# EAGLE design stairs (EAGLE 9.2.0)
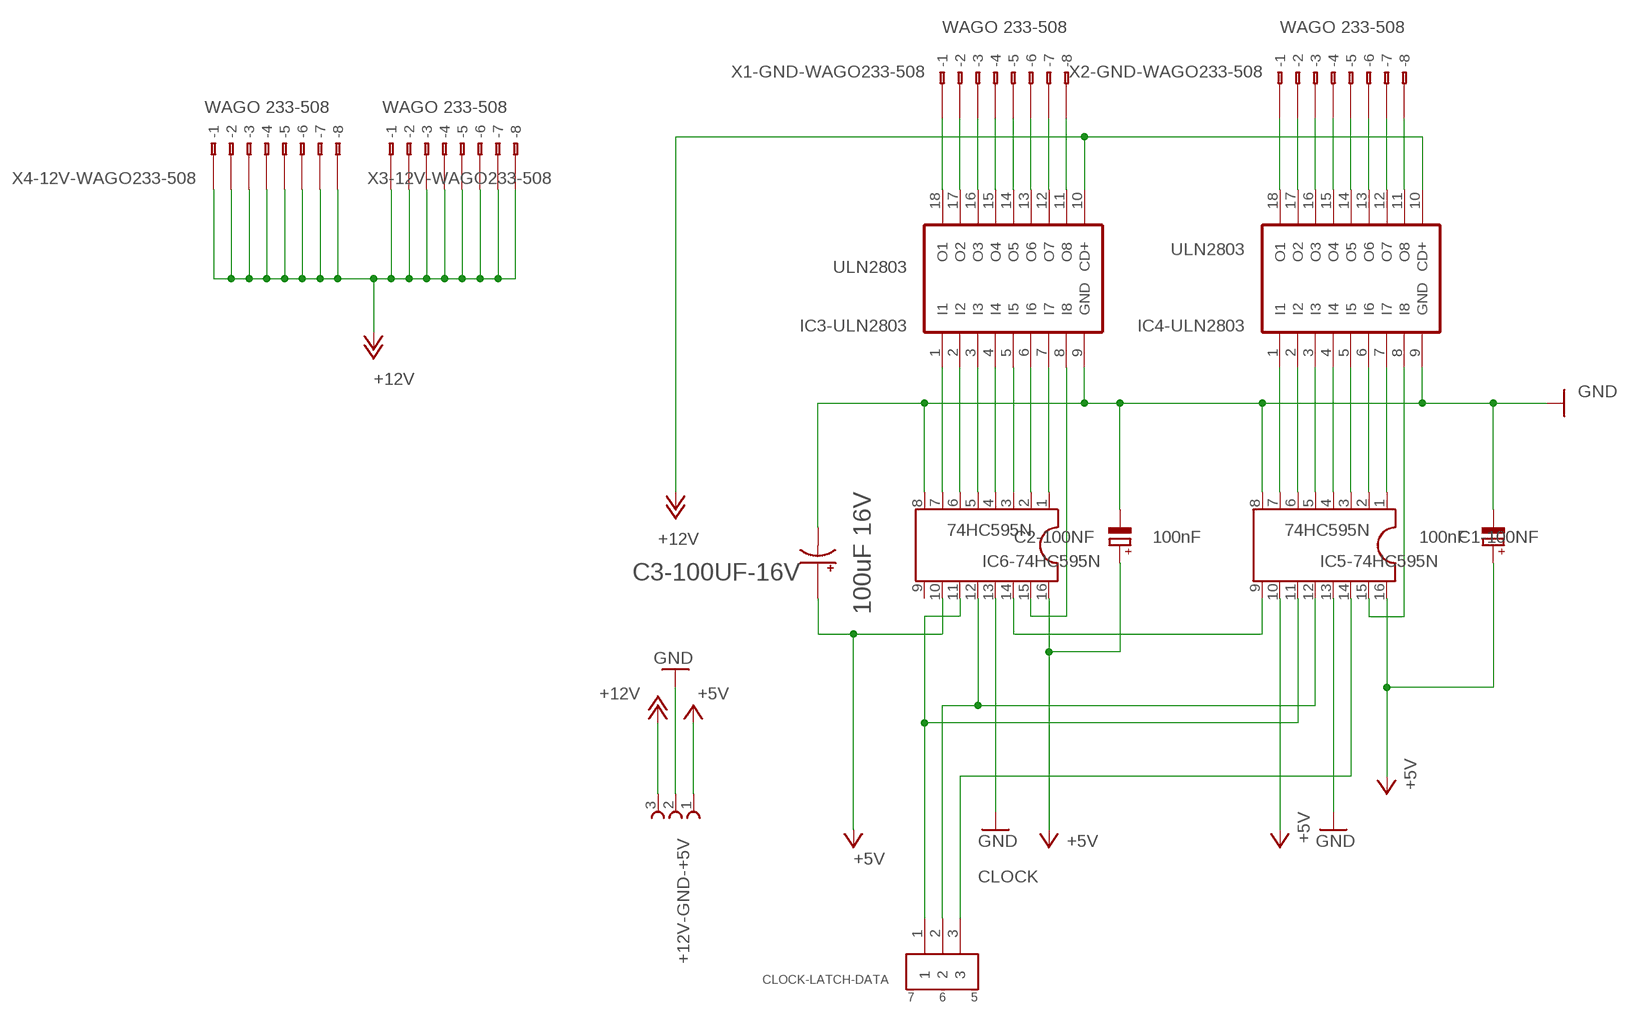
[diagram p0: schematic, sheet 1]

## Parts
+12V-GND-+5V  +12V GND +5V  691212710003  [691212710003]
C1-100NF  100nF  CPOL-EUE2,5-6E  [E2,5-6E]
C2-100NF  100nF  CPOL-EUE2,5-6E  [E2,5-6E]
C3-100UF-16V  100uF 16V  RNE1C101MDS1PX  [CAPPRD200W50D500H1000]
CLOCK-LATCH-DATA  7 6 5  0022272031  [MOLEX_0022272031]
IC3-ULN2803  ULN2803  ULN2803A  [DIL18]
IC4-ULN2803  ULN2803  ULN2803A  [DIL18]
IC5-74HC595N  74HC595N  DIL16  [DIL16]
IC6-74HC595N  74HC595N  DIL16  [DIL16]
X1-GND-WAGO233-508  WAGO 233-508  233-508  [233-508]
X2-GND-WAGO233-508  WAGO 233-508  233-508  [233-508]
X3-12V-WAGO233-508  WAGO 233-508  233-508  [233-508]
X4-12V-WAGO233-508  WAGO 233-508  233-508  [233-508]

## Nets
+5V: +12V-GND-+5V.1 C1-100NF.+ C2-100NF.+ C3-100UF-16V.1(P) IC5-74HC595N.10 IC5-74HC595N.16 IC6-74HC595N.10 IC6-74HC595N.16
+12V: +12V-GND-+5V.3 IC3-ULN2803.10(CD+) IC4-ULN2803.10(CD+) X3-12V-WAGO233-508.B1(B-1) X3-12V-WAGO233-508.B2(B-2) X3-12V-WAGO233-508.B3(B-3) X3-12V-WAGO233-508.B4(B-4) X3-12V-WAGO233-508.B5(B-5) X3-12V-WAGO233-508.B6(B-6) X3-12V-WAGO233-508.B7(B-7) X3-12V-WAGO233-508.B8(B-8) X4-12V-WAGO233-508.B1(B-1) X4-12V-WAGO233-508.B2(B-2) X4-12V-WAGO233-508.B3(B-3) X4-12V-WAGO233-508.B4(B-4) X4-12V-WAGO233-508.B5(B-5) X4-12V-WAGO233-508.B6(B-6) X4-12V-WAGO233-508.B7(B-7) X4-12V-WAGO233-508.B8(B-8)
CLOCK: CLOCK-LATCH-DATA.3 IC5-74HC595N.14
GND: +12V-GND-+5V.2 C1-100NF.- C2-100NF.- C3-100UF-16V.2(N) IC3-ULN2803.9(GND) IC4-ULN2803.9(GND) IC5-74HC595N.8 IC5-74HC595N.13 IC6-74HC595N.8 IC6-74HC595N.13
N$1: IC3-ULN2803.8(I8) IC6-74HC595N.15
N$2: IC3-ULN2803.1(I1) IC6-74HC595N.7
N$3: IC3-ULN2803.2(I2) IC6-74HC595N.6
N$4: IC3-ULN2803.3(I3) IC6-74HC595N.5
N$5: IC3-ULN2803.4(I4) IC6-74HC595N.4
N$6: IC3-ULN2803.5(I5) IC6-74HC595N.3
N$7: IC3-ULN2803.6(I6) IC6-74HC595N.2
N$8: IC3-ULN2803.7(I7) IC6-74HC595N.1
N$9: IC4-ULN2803.1(I1) IC5-74HC595N.7
N$10: IC4-ULN2803.2(I2) IC5-74HC595N.6
N$11: IC4-ULN2803.3(I3) IC5-74HC595N.5
N$12: IC4-ULN2803.4(I4) IC5-74HC595N.4
N$13: IC4-ULN2803.5(I5) IC5-74HC595N.3
N$14: IC4-ULN2803.6(I6) IC5-74HC595N.2
N$15: IC4-ULN2803.7(I7) IC5-74HC595N.1
N$16: IC3-ULN2803.18(O1) X1-GND-WAGO233-508.B1(B-1)
N$17: IC3-ULN2803.17(O2) X1-GND-WAGO233-508.B2(B-2)
N$18: IC3-ULN2803.16(O3) X1-GND-WAGO233-508.B3(B-3)
N$19: IC3-ULN2803.15(O4) X1-GND-WAGO233-508.B4(B-4)
N$20: IC3-ULN2803.14(O5) X1-GND-WAGO233-508.B5(B-5)
N$21: IC3-ULN2803.13(O6) X1-GND-WAGO233-508.B6(B-6)
N$22: IC3-ULN2803.12(O7) X1-GND-WAGO233-508.B7(B-7)
N$23: IC3-ULN2803.11(O8) X1-GND-WAGO233-508.B8(B-8)
N$24: IC4-ULN2803.18(O1) X2-GND-WAGO233-508.B1(B-1)
N$25: IC4-ULN2803.17(O2) X2-GND-WAGO233-508.B2(B-2)
N$26: IC4-ULN2803.16(O3) X2-GND-WAGO233-508.B3(B-3)
N$27: IC4-ULN2803.15(O4) X2-GND-WAGO233-508.B4(B-4)
N$28: IC4-ULN2803.14(O5) X2-GND-WAGO233-508.B5(B-5)
N$29: IC4-ULN2803.13(O6) X2-GND-WAGO233-508.B6(B-6)
N$30: IC4-ULN2803.12(O7) X2-GND-WAGO233-508.B7(B-7)
N$31: IC4-ULN2803.11(O8) X2-GND-WAGO233-508.B8(B-8)
N$32: CLOCK-LATCH-DATA.1 IC5-74HC595N.11 IC6-74HC595N.11
N$33: CLOCK-LATCH-DATA.2 IC5-74HC595N.12 IC6-74HC595N.12
N$34: IC5-74HC595N.9 IC6-74HC595N.14
N$35: IC4-ULN2803.8(I8) IC5-74HC595N.15
Unconnected: IC6-74HC595N.9 X1-GND-WAGO233-508.A1(-1) X1-GND-WAGO233-508.A2(-2) X1-GND-WAGO233-508.A3(-3) X1-GND-WAGO233-508.A4(-4) X1-GND-WAGO233-508.A5(-5) X1-GND-WAGO233-508.A6(-6) X1-GND-WAGO233-508.A7(-7) X1-GND-WAGO233-508.A8(-8) X2-GND-WAGO233-508.A1(-1) X2-GND-WAGO233-508.A2(-2) X2-GND-WAGO233-508.A3(-3) X2-GND-WAGO233-508.A4(-4) X2-GND-WAGO233-508.A5(-5) X2-GND-WAGO233-508.A6(-6) X2-GND-WAGO233-508.A7(-7) X2-GND-WAGO233-508.A8(-8) X3-12V-WAGO233-508.A1(-1) X3-12V-WAGO233-508.A2(-2) X3-12V-WAGO233-508.A3(-3) X3-12V-WAGO233-508.A4(-4) X3-12V-WAGO233-508.A5(-5) X3-12V-WAGO233-508.A6(-6) X3-12V-WAGO233-508.A7(-7) X3-12V-WAGO233-508.A8(-8) X4-12V-WAGO233-508.A1(-1) X4-12V-WAGO233-508.A2(-2) X4-12V-WAGO233-508.A3(-3) X4-12V-WAGO233-508.A4(-4) X4-12V-WAGO233-508.A5(-5) X4-12V-WAGO233-508.A6(-6) X4-12V-WAGO233-508.A7(-7) X4-12V-WAGO233-508.A8(-8)

## Library data of the parts
+12V-GND-+5V = 691212710003:691212710003: WR-TBL Serie 212 - 5.0mm 45° Entry Modular with Rising Cage Clamp - 3.5mm2 Wires, 3 Pins=>Code : Con_TBL_Screw_RisingClamp_5.00_691212710003 Created 2014-06-18, Karrer Zheng 2014 (C) Würth Elektronik; AVAILABILITY: Unavailable; DESCRIPTION: Green; Number of pins 3; Stackable; Screw terminal, Print; MF: Wurth Electronics; MP: 691212710003; PACKAGE: None; PRICE: None
C1-100NF C2-100NF = rcl:CPOL-EU: POLARIZED CAPACITOR, European symbol; SPICEPREFIX: C
C3-100UF-16V = RNE1C101MDS1PX:RNE1C101MDS1PX: CAP ALUM POLY 100UF 20% 16V T/H; AVAILABILITY: Unavailable; DESCRIPTION: Cap Aluminum Polymer 100uF 16VDC 20% _5 X 10mm_ Radial 2mm 0.035 Ohm 2300mA 2000h 105C T/R; MF: Nichicon; MP: RNE1C101MDS1PX; PACKAGE: Radial Nichicon; PRICE: None
CLOCK-LATCH-DATA = 0022272031:0022272031: CONN HEADER 3POS .100 VERT TIN; AVAILABILITY: Unavailable; DESCRIPTION: 2.54mm _.100_ Pitch KK® Wire-to-Board Header, Vertical, with Friction Lock, 3 Circuits, Tin _Sn_ Plating; MF: Molex, LLC; MP: 0022272031; PACKAGE: None; PRICE: None
IC3-ULN2803 IC4-ULN2803 = uln-udn:ULN2803A: DRIVER ARRAY
IC5-74HC595N IC6-74HC595N = ic-package:DIL16: Dual In Line / Socket
X1-GND-WAGO233-508 X2-GND-WAGO233-508 = 233-508:233-508: WAGO Cage Clamp; AVAILABILITY: Unavailable; DESCRIPTION: Spring-loaded terminal 0.50 mm² Number of pins 8 PCB T.STR. 8 POL. 2, 54 MM ORANGE WAGO Orange 220 pc_s_; MF: WAGO; MP: 233-508; PACKAGE: None; PRICE: None
X3-12V-WAGO233-508 X4-12V-WAGO233-508 = con-wago:233-508: WAGO Cage Clamp; MF: Wago Corporation; MPN: 0233-0508; OC_FARNELL: 1777101; OC_NEWARK: 79K2053

## Board
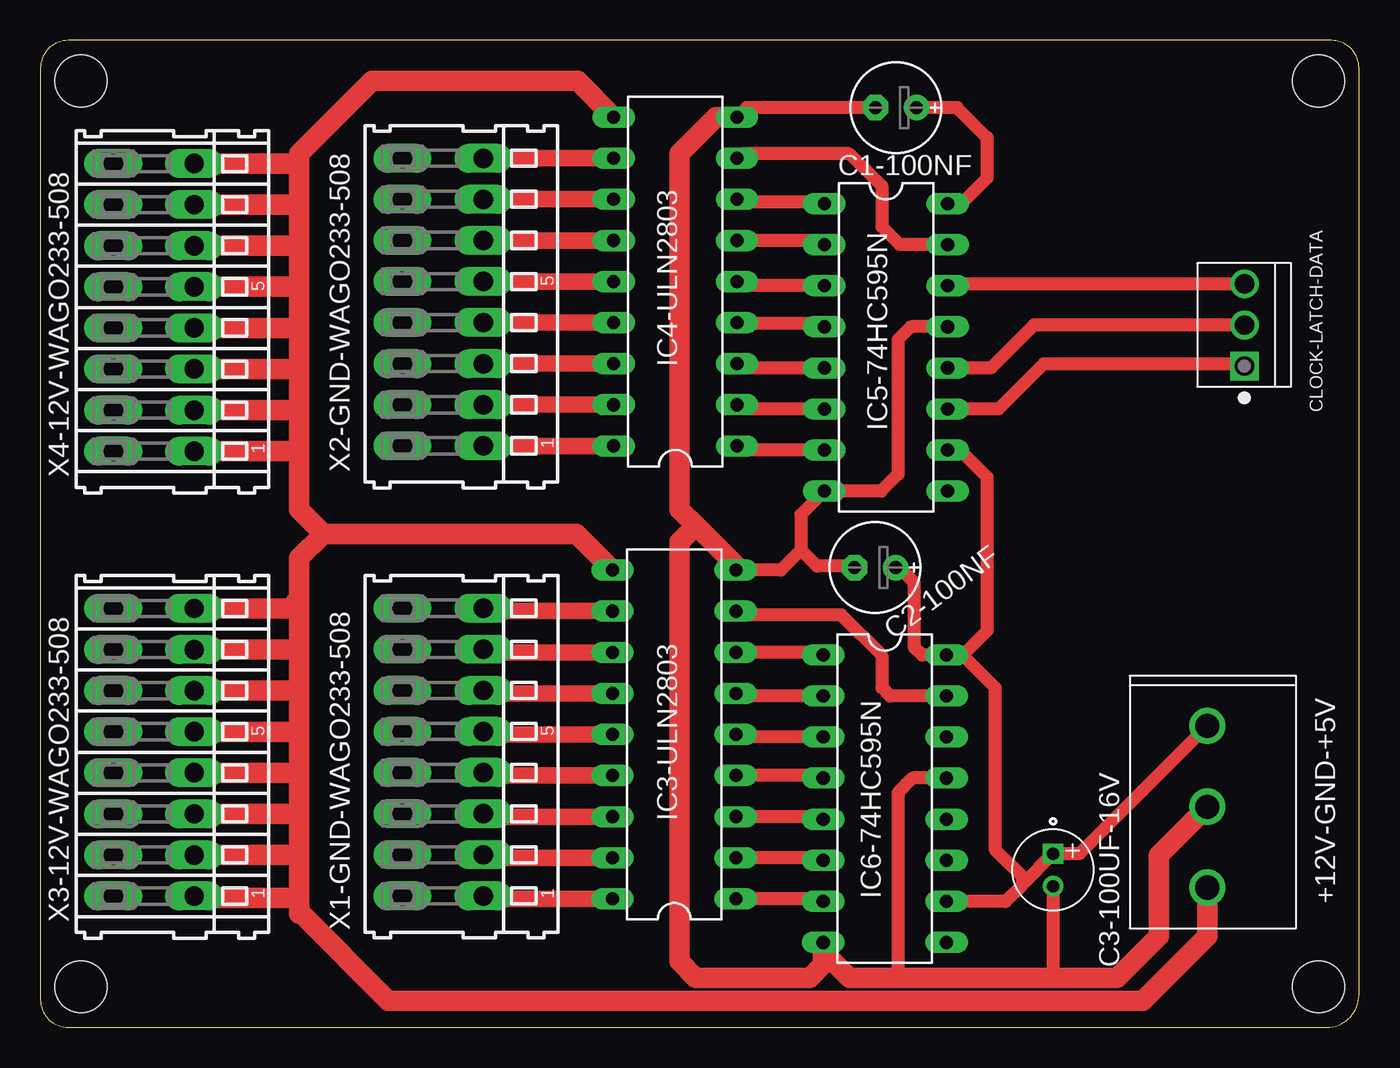
[diagram p1: board, top side]
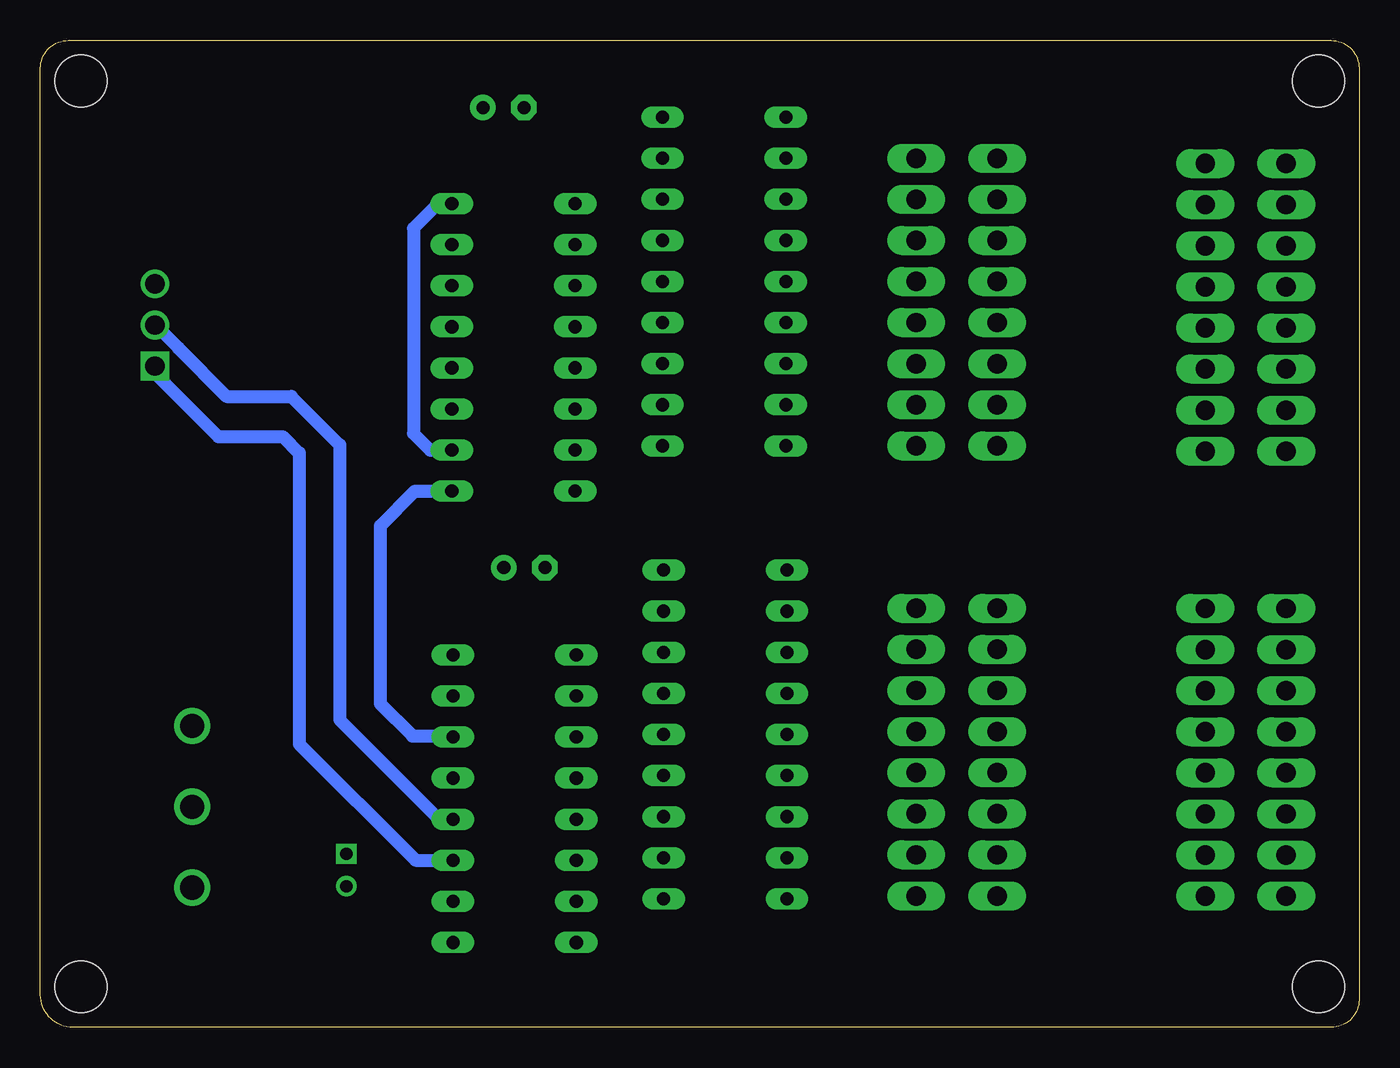
[diagram p2: board, bottom side, seen from below]

Size 81.5 x 61 mm. Coordinates in mm from the lower left corner, seen from the top.
Outline: 0,59.29 0,1.71 arc90 1.71,0 79.5,0 arc90 81.5,2 81.5,59.29 arc90 79.79,61 1.71,61 arc90 0,59.29
Copper layers (1*16): Top 0.035mm / dielectric 1.5mm / Bottom 0.035mm
Design rules "default": minimum track width 6mil, minimum drill 0.35mm, track to track 6mil, track to pad 6mil, pad to pad 6mil, via to via 6mil, smd to smd 6mil, copper to edge 40mil, drill to drill 6mil, minimum pad ring 10mil, minimum via ring 8mil, stop-mask expansion 4mil, vias tented up to drill 0mil, thermal gap 10mil
Holes 3.2 mm at 2.5,58.5 79,58.5 79,2.5 2.5,2.5

### Footprints (pad centres in the part's own frame; a part is rotated, then mirrored left to right if it is on the bottom)
691212710003 = drill 1.5: 1 -5,0; 2 0,0; 3 5,0
E2,5-6E = drill 0.813 pad 1.575: + -1.27,0 | drill 0.813 pad 1.575 octagon: - 1.27,0
CAPPRD200W50D500H1000 = drill 0.75 pad 1.15 square: 1 -1,0 | drill 0.75 pad 1.15: 2 1,0
MOLEX_0022272031 = drill 1.19 square: 1 2.54,0 | drill 1.19: 2 0,0; 3 -2.54,0
DIL18 = drill 0.813 long: 1 -10.16,-3.81; 2 -7.62,-3.81; 3 -5.08,-3.81; 4 -2.54,-3.81; 5 0,-3.81; 6 2.54,-3.81; 7 5.08,-3.81; 8 7.62,-3.81; 9 10.16,-3.81; 10 10.16,3.81; 11 7.62,3.81; 12 5.08,3.81; 13 2.54,3.81; 14 0,3.81; 15 -2.54,3.81; 16 -5.08,3.81; 17 -7.62,3.81; 18 -10.16,3.81
DIL16 = drill 0.813 long: 1 -8.89,-3.81; 2 -6.35,-3.81; 3 -3.81,-3.81; 4 -1.27,-3.81; 5 1.27,-3.81; 6 3.81,-3.81; 7 6.35,-3.81; 8 8.89,-3.81; 9 8.89,3.81; 10 6.35,3.81; 11 3.81,3.81; 12 1.27,3.81; 13 -1.27,3.81; 14 -3.81,3.81; 15 -6.35,3.81; 16 -8.89,3.81
233-508 = drill 1.2 long: A1 -8.89,2.5; A2 -6.35,2.5; A3 -3.81,2.5; A4 -1.27,2.5; A5 1.27,2.5; A6 3.81,2.5; A7 6.35,2.5; A8 8.89,2.5; B1 -8.89,-2.5; B2 -6.35,-2.5; B3 -3.81,-2.5; B4 -1.27,-2.5; B5 1.27,-2.5; B6 3.81,-2.5; B7 6.35,-2.5; B8 8.89,-2.5

### Placement (x,y rotation side)
+12V-GND-+5V  72.12,13.63 270 top
C1-100NF  52.88,56.85 180 top
C2-100NF  51.59,28.42 180 top
C3-100UF-16V  62.59,9.72 270 top
CLOCK-LATCH-DATA  74.42,43.41 270 top
IC3-ULN2803  39.17,18.1 90 top
IC4-ULN2803  39.24,46.1 90 top
IC5-74HC595N  52.26,42.03 270 top
IC6-74HC595N  52.19,14.13 270 top
X1-GND-WAGO233-508  24.88,17.01 90 top
X2-GND-WAGO233-508  24.87,44.83 90 top
X3-12V-WAGO233-508  7,17 90 top
X4-12V-WAGO233-508  7,44.5 90 top

### Tracks (layer width: path | path; a pad name or v marks a point on that pad's centre or on a via)
+5V
  Top 0.813: +12V-GND-+5V.1 68.13,14.64 68.13,14.63 64.22,10.72 C3-100UF-16V.1 60.69,8.82 | 60.69,8.82 59.65,7.78 IC6-74HC595N.10 | C1-100NF.+ 56.65,56.85 58.5,55 58.5,52.5 56.92,50.92 IC5-74HC595N.16 | C2-100NF.+ 53.08,28.42 54,27.5 54,23.5 54.5,23 55.98,23 IC6-74HC595N.16 | IC6-74HC595N.16 57.02,23.02 58.5,24.5 58.5,34 57,35.5 56.25,35.5 IC5-74HC595N.10 | IC6-74HC595N.16 56.98,23.02 59,21 59,11 60.69,9.32 60.69,8.82
  Bottom 0.813: IC5-74HC595N.16 56.91,50.92 58.45,49.39 58.45,36.72 57.41,35.68 IC5-74HC595N.10
+12V
  Top 1.27: 16,26.5 16,29 17.5,30.5 | 16,26.5 16,23 | 16,23 16,21 | 16,21 16,18.5 | 16,18.5 16,16 | 16,16 16,13.5 | 16,13.5 16,11 | 16,11 16,8 | 16,8 16,7 16.15,7 21.5,1.65 68.15,1.65 72.12,5.62 +12V-GND-+5V.3 | IC3-ULN2803.10 33.12,30.5 17.5,30.5 | 17.5,30.5 16,32 16,35.5 | 16,53.5 16,54 20.5,58.5 33.19,58.5 IC4-ULN2803.10 | 16,53.5 16,51 | 16,51 16,48.5 | 16,48.5 16,45.5 | 16,45.5 16,43 | 16,43 16,40.5 | 16,40.5 16,38.5 | 16,38.5 16,35.5 | 16,8 9.61,8 X3-12V-WAGO233-508.B1 | X3-12V-WAGO233-508.B2 15.65,10.65 16,11 | 16,13.5 15.69,13.19 X3-12V-WAGO233-508.B3 | X3-12V-WAGO233-508.B4 15.73,15.73 16,16 | X3-12V-WAGO233-508.B5 15.77,18.27 16,18.5 | X3-12V-WAGO233-508.B6 15.81,20.81 16,21 | X3-12V-WAGO233-508.B7 15.65,23.35 16,23 | X4-12V-WAGO233-508.B8 15.89,53.39 16,53.5 | X4-12V-WAGO233-508.B7 15.85,50.85 16,51 | X4-12V-WAGO233-508.B6 15.81,48.31 16,48.5 | X4-12V-WAGO233-508.B5 15.73,45.77 16,45.5 | X4-12V-WAGO233-508.B4 15.77,43.23 16,43 | X4-12V-WAGO233-508.B3 15.81,40.69 16,40.5 | X4-12V-WAGO233-508.B2 15.65,38.15 16,38.5 | X4-12V-WAGO233-508.B1 15.89,35.61 16,35.5 | X3-12V-WAGO233-508.B8 15.39,25.89 16,26.5
CLOCK
  Top 0.813: CLOCK-LATCH-DATA.3 56.18,45.95 IC5-74HC595N.14
GND
  Top 0.813: IC4-ULN2803.9 43.64,56.85 C1-100NF.- | C3-100UF-16V.2 62.59,3.48 63,3.07 | IC3-ULN2803.9 45.76,28.26 47,29.5 | 47,29.5 47,31.69 IC5-74HC595N.8 51.95,33.14 53,34.19 53,42.5 53.8,43.3 IC5-74HC595N.13 | C2-100NF.- 50.24,28.5 48,28.5 47,29.5 | 53,3.07 53,14.5 53.9,15.4 IC6-74HC595N.13
  Top 1.27: +12V-GND-+5V.2 69.12,10.63 69.12,5.63 66.56,3.07 63,3.07 53,3.07 50,3.07 48.38,4.69 IC6-74HC595N.8 48.38,3.88 47.57,3.07 40.5,3.07 39.5,4.07 39.5,30 40.51,31.01 | IC3-ULN2803.9 42.98,28.54 40.51,31.01 | 40.51,31.01 39.5,32.02 39.5,54 41.76,56.26 IC4-ULN2803.9
N$1
  Top 0.813: IC3-ULN2803.8 42.98,25.52 43,25.5 49.5,25.5 52,23 52,21 52.52,20.48 IC6-74HC595N.15
N$2
  Top 0.813: IC3-ULN2803.1 48.22,7.94 IC6-74HC595N.7
N$3
  Top 0.813: IC3-ULN2803.2 48.22,10.48 IC6-74HC595N.6
N$4
  Top 0.813: IC3-ULN2803.3 48.22,13.02 IC6-74HC595N.5
N$5
  Top 0.813: IC3-ULN2803.4 48.22,15.56 IC6-74HC595N.4
N$6
  Top 0.813: IC3-ULN2803.5 43.14,17.94 IC6-74HC595N.3
N$7
  Top 0.813: IC3-ULN2803.6 43.14,20.48 IC6-74HC595N.2
N$8
  Top 0.813: IC3-ULN2803.7 48.22,23.18 IC6-74HC595N.1
N$9
  Top 0.813: IC5-74HC595N.7 43.31,35.68 IC4-ULN2803.1
N$10
  Top 0.813: IC4-ULN2803.2 43.31,38.22 IC5-74HC595N.6
N$11
  Top 0.813: IC5-74HC595N.5 43.31,40.76 IC4-ULN2803.3
N$12
  Top 0.813: IC4-ULN2803.4 43.44,43.56 43.5,43.5 48.5,43.5 48.3,43.3 IC5-74HC595N.4
N$13
  Top 0.813: IC4-ULN2803.5 43.4,46.1 43.66,45.84 IC5-74HC595N.3
N$14
  Top 0.813: IC4-ULN2803.6 48.86,48.64 49,48.5 48.88,48.38 IC5-74HC595N.2
N$15
  Top 0.813: IC4-ULN2803.7 43.23,51 48.37,51 IC5-74HC595N.1
N$16
  Top 1.016: IC3-ULN2803.18 27.56,7.94 X1-GND-WAGO233-508.B1
N$17
  Top 1.016: IC3-ULN2803.17 27.56,10.48 X1-GND-WAGO233-508.B2
N$18
  Top 1.016: IC3-ULN2803.16 27.56,13.02 X1-GND-WAGO233-508.B3
N$19
  Top 1.016: IC3-ULN2803.15 27.56,15.56 X1-GND-WAGO233-508.B4
N$20
  Top 1.016: IC3-ULN2803.14 27.56,18.1 X1-GND-WAGO233-508.B5
N$21
  Top 1.016: IC3-ULN2803.13 27.56,20.64 X1-GND-WAGO233-508.B6
N$22
  Top 1.016: IC3-ULN2803.12 27.56,23.18 X1-GND-WAGO233-508.B7
N$23
  Top 1.016: IC3-ULN2803.11 27.56,25.72 X1-GND-WAGO233-508.B8
N$24
  Top 1.016: IC4-ULN2803.18 X2-GND-WAGO233-508.B1
N$25
  Top 1.016: IC4-ULN2803.17 X2-GND-WAGO233-508.B2
N$26
  Top 1.016: IC4-ULN2803.16 X2-GND-WAGO233-508.B3
N$27
  Top 1.016: IC4-ULN2803.15 X2-GND-WAGO233-508.B4
N$28
  Top 1.016: IC4-ULN2803.14 X2-GND-WAGO233-508.B5
N$29
  Top 1.016: IC4-ULN2803.13 X2-GND-WAGO233-508.B6
N$30
  Top 1.016: IC4-ULN2803.12 X2-GND-WAGO233-508.B7
N$31
  Top 1.016: IC4-ULN2803.11 X2-GND-WAGO233-508.B8
N$32
  Top 0.813: IC5-74HC595N.11 59.22,38.22 62,41 74.29,41 CLOCK-LATCH-DATA.1
  Bottom 0.813: IC6-74HC595N.11 58.32,10.32 65.5,17.5 65.5,35.5 66.5,36.5 70.5,36.5 74.42,40.42 CLOCK-LATCH-DATA.1
N$33
  Top 0.813: IC5-74HC595N.12 58.76,40.76 61.41,43.41 CLOCK-LATCH-DATA.2
  Bottom 0.813: CLOCK-LATCH-DATA.2 74.39,43.41 72.97,41.99 72.97,41.97 70,39 66,39 63,36 63,19 57,13 56.14,13 IC6-74HC595N.12
N$34
  Bottom 0.813: IC5-74HC595N.9 58.36,33.14 60.5,31 60.5,20 58.5,18 56.06,18 IC6-74HC595N.14
N$35
  Top 0.813: IC4-ULN2803.8 43.33,54 50,54 52,52 52,49.5 53.12,48.38 IC5-74HC595N.15